# EAGLE design USBasp (EAGLE 4.16)
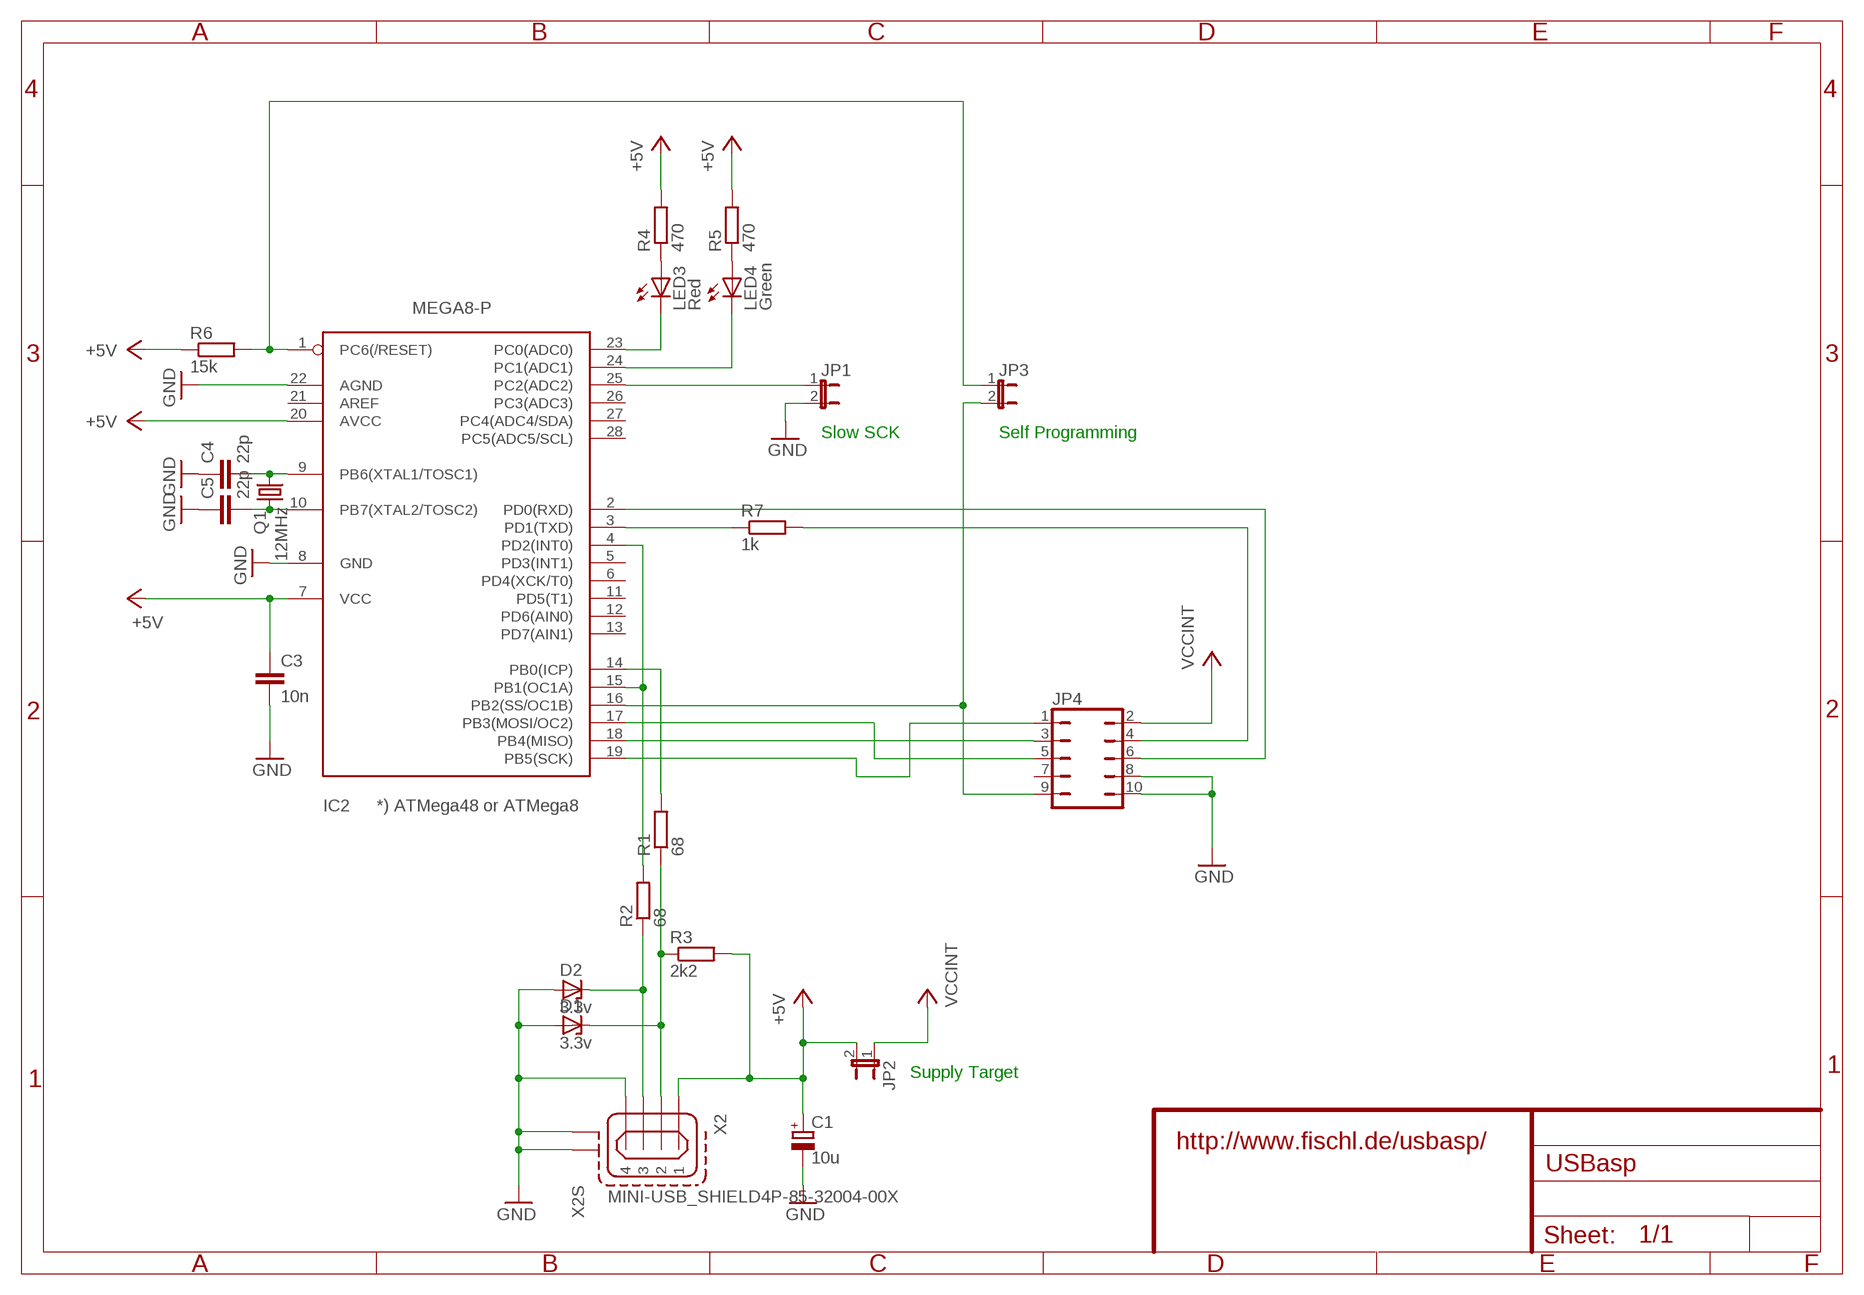
[diagram p0: schematic, sheet 1]

## Parts
C1  10u  CPOL-EUE/7260-38R  [E/7260-38R]
C3  10n  C-EUC0805  [C0805]
C4  22p  C-EUC0805  [C0805]
C5  22p  C-EUC0805  [C0805]
D1  3.3v  ZENER-DIODEZD-5  [ZDIO-5]
D2  3.3v  ZENER-DIODEZD-5  [ZDIO-5]
IC2  MEGA8-P  [DIL28-3]
JP1  JP1E  [JP1]
JP2  JP1E  [JP1]
JP3  JP1E  [JP1]
JP4  JP5Q  [JP5Q]
LED3  Red  LED5MM  [LED5MM]
LED4  Green  LED5MM  [LED5MM]
Q1  12MHz  CRYTALHC49S  [HC49/S]
R1  68  R-EU_M0805  [M0805]
R2  68  R-EU_M0805  [M0805]
R3  2k2  R-EU_M0805  [M0805]
R4  470  R-EU_M0805  [M0805]
R5  470  R-EU_M0805  [M0805]
R6  15k  R-EU_M0805  [M0805]
R7  1k  R-EU_M0805  [M0805]
X2  MINI-USB_SHIELD4P-85-32004-00X  [85-32004-00X]

## Nets
+5V: C1.+ C3.1 IC2.7(VCC) IC2.20(AVCC) JP2.2 R3.2 R4.2 R5.2 R6.1 X2.1
GND: C1.- C3.2 C4.1 C5.1 D1.A D2.A IC2.8(GND) IC2.22(AGND) JP1.2 JP4.8 JP4.10 X2.4 X2.M1(S1) X2.M2(S2)
N$1: IC2.1(PC6(/RESET)) JP3.1 R6.2
N$2: IC2.16(PB2(SS/OC1B)) JP3.2 JP4.9
N$3: IC2.17(PB3(MOSI/OC2)) JP4.5
N$4: IC2.19(PB5(SCK)) JP4.1
N$5: D1.C R1.1 R3.1 X2.2
N$6: IC2.18(PB4(MISO)) JP4.3
N$7: IC2.4(PD2(INT0)) IC2.15(PB1(OC1A)) R2.2
N$8: D2.C R2.1 X2.3
N$9: IC2.3(PD1(TXD)) R7.1
N$10: JP4.4 R7.2
N$11: IC2.2(PD0(RXD)) JP4.6
N$12: IC2.25(PC2(ADC2)) JP1.1
N$13: LED3.A R4.1
N$14: IC2.23(PC0(ADC0)) LED3.K(C)
N$15: IC2.24(PC1(ADC1)) LED4.K(C)
N$16: IC2.14(PB0(ICP)) R1.2
N$17: LED4.A R5.1
N$22: C4.2 IC2.9(PB6(XTAL1/TOSC1)) Q1.2
N$23: C5.2 IC2.10(PB7(XTAL2/TOSC2)) Q1.1
VCCINT: JP2.1 JP4.2
Unconnected: IC2.5(PD3(INT1)) IC2.6(PD4(XCK/T0)) IC2.11(PD5(T1)) IC2.12(PD6(AIN0)) IC2.13(PD7(AIN1)) IC2.21(AREF) IC2.26(PC3(ADC3)) IC2.27(PC4(ADC4/SDA)) IC2.28(PC5(ADC5/SCL)) JP4.7

## Notes on the sheet
- Slow SCK | Self Programming
- *) ATMega48 or ATMega8
- Supply Target
- http://www.fischl.de/usbasp/

## Library data of the parts
C1 = rcl:CPOL-EU: POLARIZED CAPACITOR, European symbol
C3-C5 = rcl:C-EU: CAPACITOR, European symbol
D1 D2 = diode:ZENER-DIODE: Z-Diode
IC2 = atmel:MEGA8-P: MICROCONTROLLER 8 Kbytes FLASH 1 kbytes SRAM 512 bytes EEPROM USART 4-channel 10 bit ADC 2-channel 8 bit ADC Source: avr.lbr
JP1-JP3 = jumper:JP1E: JUMPER
JP4 = jumper:JP5Q: JUMPER
LED3 LED4 = led:LED: LED OSRAM: - CHIPLED LG R971, LG N971, LY N971, LG Q971, LY Q971, LO R971, LY R971 LH N974, LH R974 LS Q976, LO Q976, LY Q976 LO Q996 - Hyper CHIPLED LW Q18S LB Q993, LB Q99A, LB R99A - SideLED LS A670, LO A670, LY A670, LG A670, LP A670 LB A673, LV A673, LT A673, LW A673 LH A674 LY A675 LS A676, LA A676, LO A676, LY A676, LW A676 LS A679, LY A679, LG A679 - Hyper Micro SIDELED® LS Y876, LA Y876, LO Y876, LY Y876 LT Y87S - SmartLED LW L88C, LW L88S LB L89C, LB L89S, LG L890 LS L89K, LO L89K, LY L89K LS L896, LA L896, LO L896, LY L896 - TOPLED LS T670, LO T670, LY T670, LG T670, LP T670 LSG T670, LSP T670, LSY T670, LOP T670, LYG T670 LG T671, LOG T671, LSG T671 LB T673, LV T673, LT T673, LW T673 LH T674 LS T676, LA T676, LO T676, LY T676, LB T676, LH T676, LSB T676, LW T676 LB T67C, LV T67C, LT T67C, LS T67K, LO T67K, LY T67K, LW E67C LS E67B, LA E67B, LO E67B, LY E67B, LB E67C, LV E67C, LT E67C LW T67C LS T679, LY T679, LG T679 LS T770, LO T770, LY T770, LG T770, LP T770 LB T773, LV T773, LT T773, LW T773 LH T774 LS E675, LA E675, LY E675, LS T675 LS T776, LA T776, LO T776, LY T776, LB T776 LHGB T686 LT T68C, LB T68C - Hyper Mini TOPLED® LB M676 - Mini TOPLED Santana® LG M470 LS M47K, LO M47K, LY M47K Source: http://www.osram.convergy.de - LUMILED® LXK2-PW12-R00, LXK2-PW12-S00, LXK2-PW14-U00, LXK2-PW14-V00 LXK2-PM12-R00, LXK2-PM12-S00, LXK2-PM14-U00 LXK2-PE12-Q00, LXK2-PE12-R00, LXK2-PE12-S00, LXK2-PE14-T00, LXK2-PE14-U00 LXK2-PB12-K00, LXK2-PB12-L00, LXK2-PB12-M00, LXK2-PB14-N00, LXK2-PB14-P00, LXK2-PB14-Q00 LXK2-PR12-L00, LXK2-PR12-M00, LXK2-PR14-Q00, LXK2-PR14-R00 LXK2-PD12-Q00, LXK2-PD12-R00, LXK2-PD12-S00 LXK2-PH12-R00, LXK2-PH12-S00 LXK2-PL12-P00, LXK2-PL12-Q00, LXK2-PL12-R00 Source: www.luxeon.com
Q1 = crystal:CRYTAL: CRYSTAL
R1-R7 = rcl:R-EU_: RESISTOR, European symbol
X2 = con-cypressindustries:MINI-USB_SHIELD4P-: MINI USB 4 Pol. Source: www.cypressindustries.com

## Board
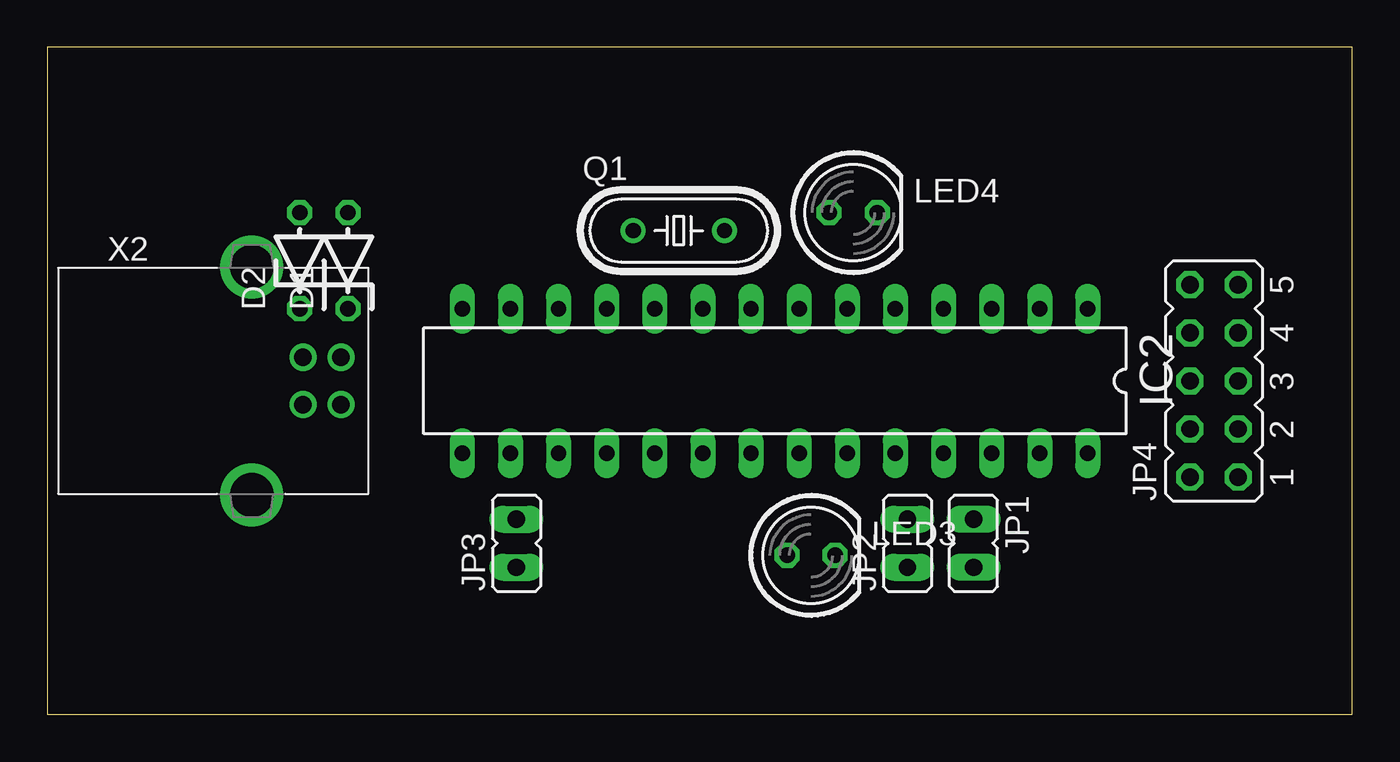
[diagram p1: board, top side]
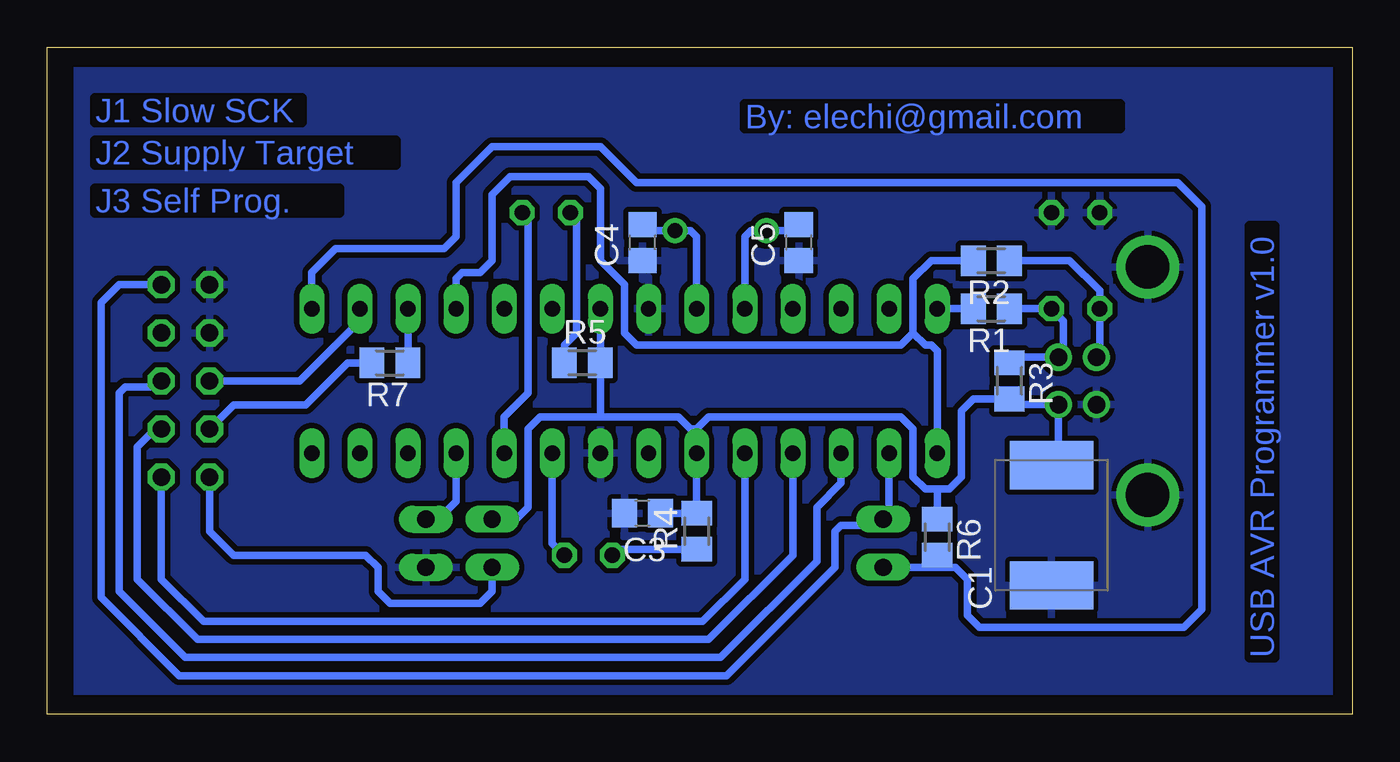
[diagram p2: board, bottom side, seen from below]

Size 68.88 x 35.23 mm. Coordinates in mm from the lower left corner, seen from the top.
Outline: 0,0 68.88,0 68.88,35.23 0,35.23 0,0
Copper layers (1*16): Top 0.035mm / dielectric 1.5mm / Bottom 0.035mm
Design rules "default": minimum track width 10mil, minimum drill 24mil, track to track 11mil, track to pad 11mil, pad to pad 8mil, via to via 8mil, smd to smd 8mil, copper to edge 40mil, drill to drill 8mil, minimum pad ring 10mil, minimum via ring 8mil, stop-mask expansion 4mil, vias tented up to drill 0mil, thermal gap 10mil

### Footprints (pad centres in the part's own frame; a part is rotated, then mirrored left to right if it is on the bottom)
E/7260-38R = smd 2.55 x 4.4: + 3.175,0; - -3.175,0
C0805 = smd 1.3 x 1.5: 1 -0.95,0; 2 0.95,0
ZDIO-5 = drill 0.813 octagon: A 2.54,0; C -2.54,0
DIL28-3 = drill 0.813 long: 1 -16.51,-3.81; 2 -13.97,-3.81; 3 -11.43,-3.81; 4 -8.89,-3.81; 5 -6.35,-3.81; 6 -3.81,-3.81; 7 -1.27,-3.81; 8 1.27,-3.81; 9 3.81,-3.81; 10 6.35,-3.81; 11 8.89,-3.81; 12 11.43,-3.81; 13 13.97,-3.81; 14 16.51,-3.81; 15 16.51,3.81; 16 13.97,3.81; 17 11.43,3.81; 18 8.89,3.81; 19 6.35,3.81; 20 3.81,3.81; 21 1.27,3.81; 22 -1.27,3.81; 23 -3.81,3.81; 24 -6.35,3.81; 25 -8.89,3.81; 26 -11.43,3.81; 27 -13.97,3.81; 28 -16.51,3.81
JP1 = drill 0.914 long: 1 0,-1.27; 2 0,1.27
JP5Q = drill 0.914 octagon: 1 -5.08,-1.27; 2 -5.08,1.27; 3 -2.54,-1.27; 4 -2.54,1.27; 5 0,-1.27; 6 0,1.27; 7 2.54,-1.27; 8 2.54,1.27; 9 5.08,-1.27; 10 5.08,1.27
LED5MM = drill 0.813 octagon: A -1.27,0; K 1.27,0
HC49/S = drill 0.813 round: 1 -2.413,0; 2 2.413,0
M0805 = smd 1.3 x 1.6: 1 -0.95,0; 2 0.95,0
85-32004-00X = drill 0.92 pad 1.27 round: 1 4.71,-1.25; 2 4.71,1.25; 3 2.71,1.25; 4 2.71,-1.25 | drill 2.3 pad 3 round: M1 0,6.02; M2 0,-6.02

### Placement (x,y rotation side)
C1  15.87,10 90 bottom
C3  37.46,10.63 180 bottom
C4  37.46,24.92 90 bottom
C5  29.2,24.92 90 bottom
D1  15.87,23.96 90 top
D2  13.33,23.96 90 top
IC2  38.41,17.62 180 top
JP1  48.89,9.04 180 top
JP2  45.4,9.04 0 top
JP3  24.76,9.04 0 top
JP4  61.59,17.62 90 top
LED3  40.32,8.41 0 top
LED4  42.54,26.51 0 top
Q1  33.33,25.55 0 top
R1  19.04,21.43 180 bottom
R2  19.04,23.96 180 bottom
R3  18.09,17.62 270 bottom
R4  34.6,9.68 90 bottom
R5  40.64,18.57 0 bottom
R6  21.9,9.36 270 bottom
R7  50.8,18.57 180 bottom
X2  10.79,17.62 0 top

### Tracks (layer width: path | path; a pad name or v marks a point on that pad's centre or on a via)
+5V
  Bottom 0.406: C1.+ 15.5,13.54 X2.1 17.79,16.37 R3.2 19.99,16.66 20.63,16.03 20.63,12.54 21.27,11.9 21.9,11.9 | 21.9,11.9 22.54,11.9 23.17,12.54 23.17,15.08 23.81,15.71 33.97,15.71 34.6,15.08 | 34.6,15.08 IC2.20 R4.2 | 21.9,11.9 R6.1 | R4.2 34.6,10.31 | JP2.2 44.13,10.31 43.49,10.95 43.49,15.08 42.86,15.71 39.68,15.71 | 39.68,15.71 35.55,15.71 34.92,15.08 34.6,15.08 | C3.1 R4.2 | IC2.7 R5.2 | 39.68,15.71 39.69,15.71 | R5.2 | 39.68,15.71 R5.2
GND
  pour Bottom: 67.3,34.44 67.3,0.79 0.63,0.79 0.63,34.44
N$1
  Bottom 0.406: R6.2 22.54,7.77 JP3.1 20.95,7.77 20.31,7.14 20.31,5.23 19.68,4.6 8.89,4.6 7.93,5.55 7.93,26.82 9.2,28.09 37.78,28.09 39.68,30 45.4,30 47.3,28.09 47.3,25.23 47.94,24.6 53.65,24.6 54.92,23.33 IC2.1 54.92,21.11
N$2
  Bottom 0.406: IC2.16 24.44,10.63 JP3.2 24.76,10.63 25.39,10 26.98,10 27.3,9.68 27.3,7.77 33.02,2.06 61.91,2.06 66.03,6.18 66.03,21.74 65.08,22.7 JP4.9
N$3
  Bottom 0.406: IC2.17 26.98,12.22 28.25,10.95 28.25,8.09 33.33,3.01 61.59,3.01 65.08,6.5 65.08,16.98 64.77,17.3 63.18,17.3 JP4.5
N$4
  Bottom 0.406: IC2.19 32.06,7.14 34.29,4.92 60.64,4.92 62.86,7.14 JP4.1
N$5
  Bottom 0.406: 15.55,18.89 15.53,18.87 X2.2 | 15.55,18.89 15.24,19.2 15.24,20.79 D1.C R1.1 | R3.1 17.78,18.57 17.46,18.89 15.55,18.89
N$6
  Bottom 0.406: IC2.18 29.52,8.41 33.97,3.96 60.96,3.96 64.13,7.14 64.13,14.12 63.5,14.76 63.18,14.76 JP4.3
N$7
  Bottom 0.406: R2.2 22.22,23.96 23.17,23.01 23.17,20.16 | 23.17,20.16 22.54,19.52 22.22,19.52 21.9,19.2 IC2.15 | 23.17,20.16 23.81,19.52 37.78,19.52 38.41,20.16 38.41,22.7 39.68,23.96 39.68,27.78 40.32,28.41 44.45,28.41 45.4,27.46 45.4,23.96 46.03,23.33 46.98,23.33 47.3,23.01 IC2.4
N$8
  Bottom 0.406: X2.3 13.33,18.87 D2.C 13.33,22.38 14.92,23.96 R2.1
N$9
  Bottom 0.406: R7.1 IC2.3
N$10
  Bottom 0.406: R7.2 53.02,18.57 55.24,16.35 59.05,16.35 JP4.4
N$11
  Bottom 0.406: IC2.2 52.38,20.79 55.56,17.62 JP4.6
N$12
  Bottom 0.406: IC2.25 47.3,11.27 48.26,10.31 JP1.1
N$13
  Bottom 0.406: R4.1 38.73,8.73 LED3.A
N$14
  Bottom 0.406: LED3.K 42.22,9.04 IC2.23
N$15
  Bottom 0.406: LED4.K 43.49,26.19 43.49,16.98 44.76,15.71 IC2.24
N$16
  Bottom 0.406: R1.2 IC2.14
N$17
  Bottom 0.406: LED4.A 40.95,26.19 40.95,20.16 41.59,19.52 R5.1
N$18
  pour Bottom: 1.27,33.81 66.67,33.81 66.67,1.42 1.27,1.42
N$22
  Bottom 0.406: C4.2 37.14,25.55 Q1.2 34.92,25.55 34.6,25.23 IC2.9
N$23
  Bottom 0.406: C5.2 29.52,25.55 Q1.1 31.74,25.55 32.06,25.23 IC2.10
VCCINT
  Bottom 0.406: JP2.1 45.4,6.5 46.03,5.87 50.8,5.87 51.43,6.5 51.43,7.77 52.07,8.41 59.05,8.41 60.32,9.68 JP4.2

### Text on the board
Bottom: By: elechi@gmail.com | J1 Slow SCK | J2 Supply Target | J3 Self Prog. | USB AVR Programmer v1.0